# Altium schematic sheet PIC.Schematic.SchDoc
size A
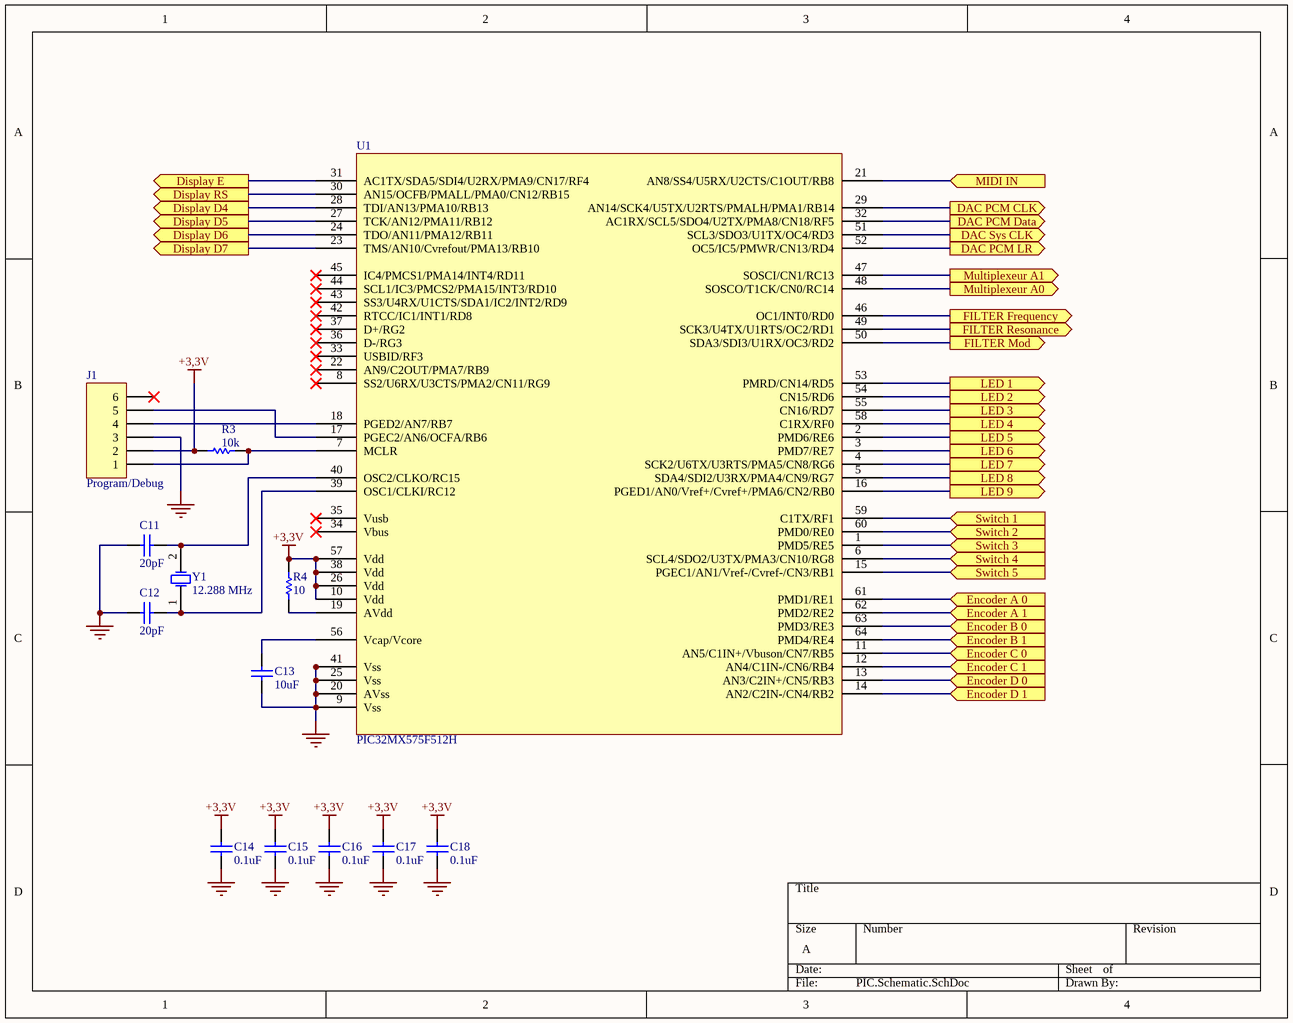
[diagram p0: PIC.Schematic.SchDoc]

## Parts
C11  20pF  [CAPC1608N - cap]
C12  20pF  [CAPC1608N - cap]
C13  10uF  [CAPC1608N]
C14  0.1uF  [CAPC1608N - cap]
C15  0.1uF  [CAPC1608N - cap]
C16  0.1uF  [CAPC1608N - cap]
C17  0.1uF  [CAPC1608N - cap]
C18  0.1uF  [CAPC1608N - cap]
J1  Program/Debug  [RJ11]
R3  10k  [CAPC1608N]
R4  10  [CAPC1608N]
U1  PIC32MX575F512H  [PIC32]
Y1  12.288 MHz  [Xtal]

## Ports
DAC PCM CLK (out), DAC PCM Data (out), DAC PCM LR (out), DAC Sys CLK (out), Display D4 (out), Display D5 (out), Display D6 (out), Display D7 (out), Display E (out), Display RS (out), Encoder A 0 (in), Encoder A 1 (in), Encoder B 0 (in), Encoder B 1 (in), Encoder C 0 (in), Encoder C 1 (in), Encoder D 0 (in), Encoder D 1 (in), FILTER Frequency (out), FILTER Mod (out), FILTER Resonance (out), LED 1 (out), LED 2 (out), LED 3 (out), LED 4 (out), LED 5 (out), LED 6 (out), LED 7 (out), LED 8 (out), LED 9 (out), MIDI IN (in), Multiplexeur A0 (out), Multiplexeur A1 (out), Switch 1 (in), Switch 2 (in), Switch 3 (in), Switch 4 (in), Switch 5 (in)

## Nets
+3,3V: C14.2 C15.2 C16.2 C17.2 C18.2 J1.2 R3.2 R4.1 U1.10(Vdd) U1.26(Vdd) U1.38(Vdd) U1.57(Vdd)
GND: C11.1 C12.1 C13.1 C14.1 C15.1 C16.1 C17.1 C18.1 J1.3 U1.9(Vss) U1.20(AVss) U1.25(Vss) U1.41(Vss)
DAC PCM CLK: U1.29(AN14/SCK4/U5TX/U2RTS/PMALH/PMA1/RB14) ; port DAC PCM CLK
DAC PCM Data: U1.32(AC1RX/SCL5/SDO4/U2TX/PMA8/CN18/RF5) ; port DAC PCM Data
DAC PCM LR: U1.52(OC5/IC5/PMWR/CN13/RD4) ; port DAC PCM LR
DAC Sys CLK: U1.51(SCL3/SDO3/U1TX/OC4/RD3) ; port DAC Sys CLK
Display D4: U1.28(TDI/AN13/PMA10/RB13) ; port Display D4
Display D5: U1.27(TCK/AN12/PMA11/RB12) ; port Display D5
Display D6: U1.24(TDO/AN11/PMA12/RB11) ; port Display D6
Display D7: U1.23(TMS/AN10/Cvrefout/PMA13/RB10) ; port Display D7
Display E: U1.31(AC1TX/SDA5/SDI4/U2RX/PMA9/CN17/RF4) ; port Display E
Display RS: U1.30(AN15/OCFB/PMALL/PMA0/CN12/RB15) ; port Display RS
Encoder A 0: U1.61(PMD1/RE1) ; port Encoder A 0
Encoder A 1: U1.62(PMD2/RE2) ; port Encoder A 1
Encoder B 0: U1.63(PMD3/RE3) ; port Encoder B 0
Encoder B 1: U1.64(PMD4/RE4) ; port Encoder B 1
Encoder C 0: U1.11(AN5/C1IN+/Vbuson/CN7/RB5) ; port Encoder C 0
Encoder C 1: U1.12(AN4/C1IN-/CN6/RB4) ; port Encoder C 1
Encoder D 0: U1.13(AN3/C2IN+/CN5/RB3) ; port Encoder D 0
Encoder D 1: U1.14(AN2/C2IN-/CN4/RB2) ; port Encoder D 1
FILTER Frequency: U1.46(OC1/INT0/RD0) ; port FILTER Frequency
FILTER Mod: U1.50(SDA3/SDI3/U1RX/OC3/RD2) ; port FILTER Mod
FILTER Resonance: U1.49(SCK3/U4TX/U1RTS/OC2/RD1) ; port FILTER Resonance
LED 1: U1.53(PMRD/CN14/RD5) ; port LED 1
LED 2: U1.54(CN15/RD6) ; port LED 2
LED 3: U1.55(CN16/RD7) ; port LED 3
LED 4: U1.58(C1RX/RF0) ; port LED 4
LED 5: U1.2(PMD6/RE6) ; port LED 5
LED 6: U1.3(PMD7/RE7) ; port LED 6
LED 7: U1.4(SCK2/U6TX/U3RTS/PMA5/CN8/RG6) ; port LED 7
LED 8: U1.5(SDA4/SDI2/U3RX/PMA4/CN9/RG7) ; port LED 8
LED 9: U1.16(PGED1/AN0/Vref+/Cvref+/PMA6/CN2/RB0) ; port LED 9
MIDI IN: U1.21(AN8/SS4/U5RX/U2CTS/C1OUT/RB8) ; port MIDI IN
Multiplexeur A0: U1.48(SOSCO/T1CK/CN0/RC14) ; port Multiplexeur A0
Multiplexeur A1: U1.47(SOSCI/CN1/RC13) ; port Multiplexeur A1
Switch 1: U1.59(C1TX/RF1) ; port Switch 1
Switch 2: U1.60(PMD0/RE0) ; port Switch 2
Switch 3: U1.1(PMD5/RE5) ; port Switch 3
Switch 4: U1.6(SCL4/SDO2/U3TX/PMA3/CN10/RG8) ; port Switch 4
Switch 5: U1.15(PGEC1/AN1/Vref-/Cvref-/CN3/RB1) ; port Switch 5
NetC11_2: C11.2 U1.40(OSC2/CLKO/RC15) Y1.2(OSC2)
NetC12_2: C12.2 U1.39(OSC1/CLKI/RC12) Y1.1(OSC1)
NetC13_2: C13.2 U1.56(Vcap/Vcore)
NetJ1_1: J1.1 R3.1 U1.7(MCLR)
NetJ1_4: J1.4 U1.18(PGED2/AN7/RB7)
NetJ1_5: J1.5 U1.17(PGEC2/AN6/OCFA/RB6)
NetR4_2: R4.2 U1.19(AVdd)

Not connected (* = marked no-connect by the designer): J1 6*; U1 8(SS2/U6RX/U3CTS/PMA2/CN11/RG9)* 22(AN9/C2OUT/PMA7/RB9)* 33(USBID/RF3)* 34(Vbus)* 35(Vusb)* 36(D-/RG3)* 37(D+/RG2)* 42(RTCC/IC1/INT1/RD8)* 43(SS3/U4RX/U1CTS/SDA1/IC2/INT2/RD9)* 44(SCL1/IC3/PMCS2/PMA15/INT3/RD10)* 45(IC4/PMCS1/PMA14/INT4/RD11)*

## Library data of the parts
C11 C12 = Cap Semi: Capacitor (Semiconductor SIM Model); Value: 20p; Published: 8-Jun-2000; LatestRevisionDate: 29-May-2009; LatestRevisionNote: IPC-7351 Footprint Added.; PackageReference: C1206; Publisher: Altium Limited; PackageDescription: Chip Capacitor
C13 = Cap: Capacitor; Published: 8-Jun-2000; LatestRevisionDate: 17-Jul-2002; LatestRevisionNote: Re-released for DXP Platform.; PackageReference: RAD-0.3; Publisher: Altium Limited; PackageDescription: Radial Cap, Thru-Hole; 2 Leads; 0.3 in Pin Spacing; Value: 10uF
C14-C18 = Cap Semi: Capacitor (Semiconductor SIM Model); Value: 0.1u; Published: 8-Jun-2000; LatestRevisionDate: 29-May-2009; LatestRevisionNote: IPC-7351 Footprint Added.; PackageReference: C1206; Publisher: Altium Limited; PackageDescription: Chip Capacitor
J1 = Header 6H: Header, 6-Pin, Right Angle; Ref_Fabricant: 615006138521; Fabricant: Würth Elektronik; LatestRevisionDate: 17-Jul-2002; LatestRevisionNote: Re-released for DXP Platform.; Publisher: Altium Limited; Datasheet: http://www.farnell.com/datasheets/76611.pdf; Ref_Farnell: 1642041
R3 = Res1: Resistor; Published: 8-Jun-2000; LatestRevisionDate: 17-Jul-2002; LatestRevisionNote: Re-released for DXP Platform.; PackageReference: AXIAL-0.3; Publisher: Altium Limited; PackageDescription: Axial Device, Thru-Hole; 2 Leads; 0.3 in Pin Spacing; Value: 10K
R4 = Res1: Resistor; Value: 10R; Published: 8-Jun-2000; LatestRevisionDate: 17-Jul-2002; LatestRevisionNote: Re-released for DXP Platform.; PackageReference: AXIAL-0.3; Publisher: Altium Limited; PackageDescription: Axial Device, Thru-Hole; 2 Leads; 0.3 in Pin Spacing
U1 = PIC32 MX575F512H
Y1 = XTAL: Crystal Oscillator; Ref_Fabricant: FOXSLF/128-20; Fabricant: Fox Electronic; Published: 8-Jun-2000; LatestRevisionDate: 17-Jul-2002; LatestRevisionNote: Re-released for DXP Platform.; PackageReference: R38; Publisher: Altium Limited; PackageDescription: Crystal, Thru-Hole; 2 Leads; Body 3.1 x 8.2 mm (Dia.xH); Datasheet: http://www.farnell.com/datasheets/1911270.pdf; Ref_Farnell: 2063995